# Altium schematic sheet CO2_Sensor_Unit_board - Copy.SchDoc
size A2
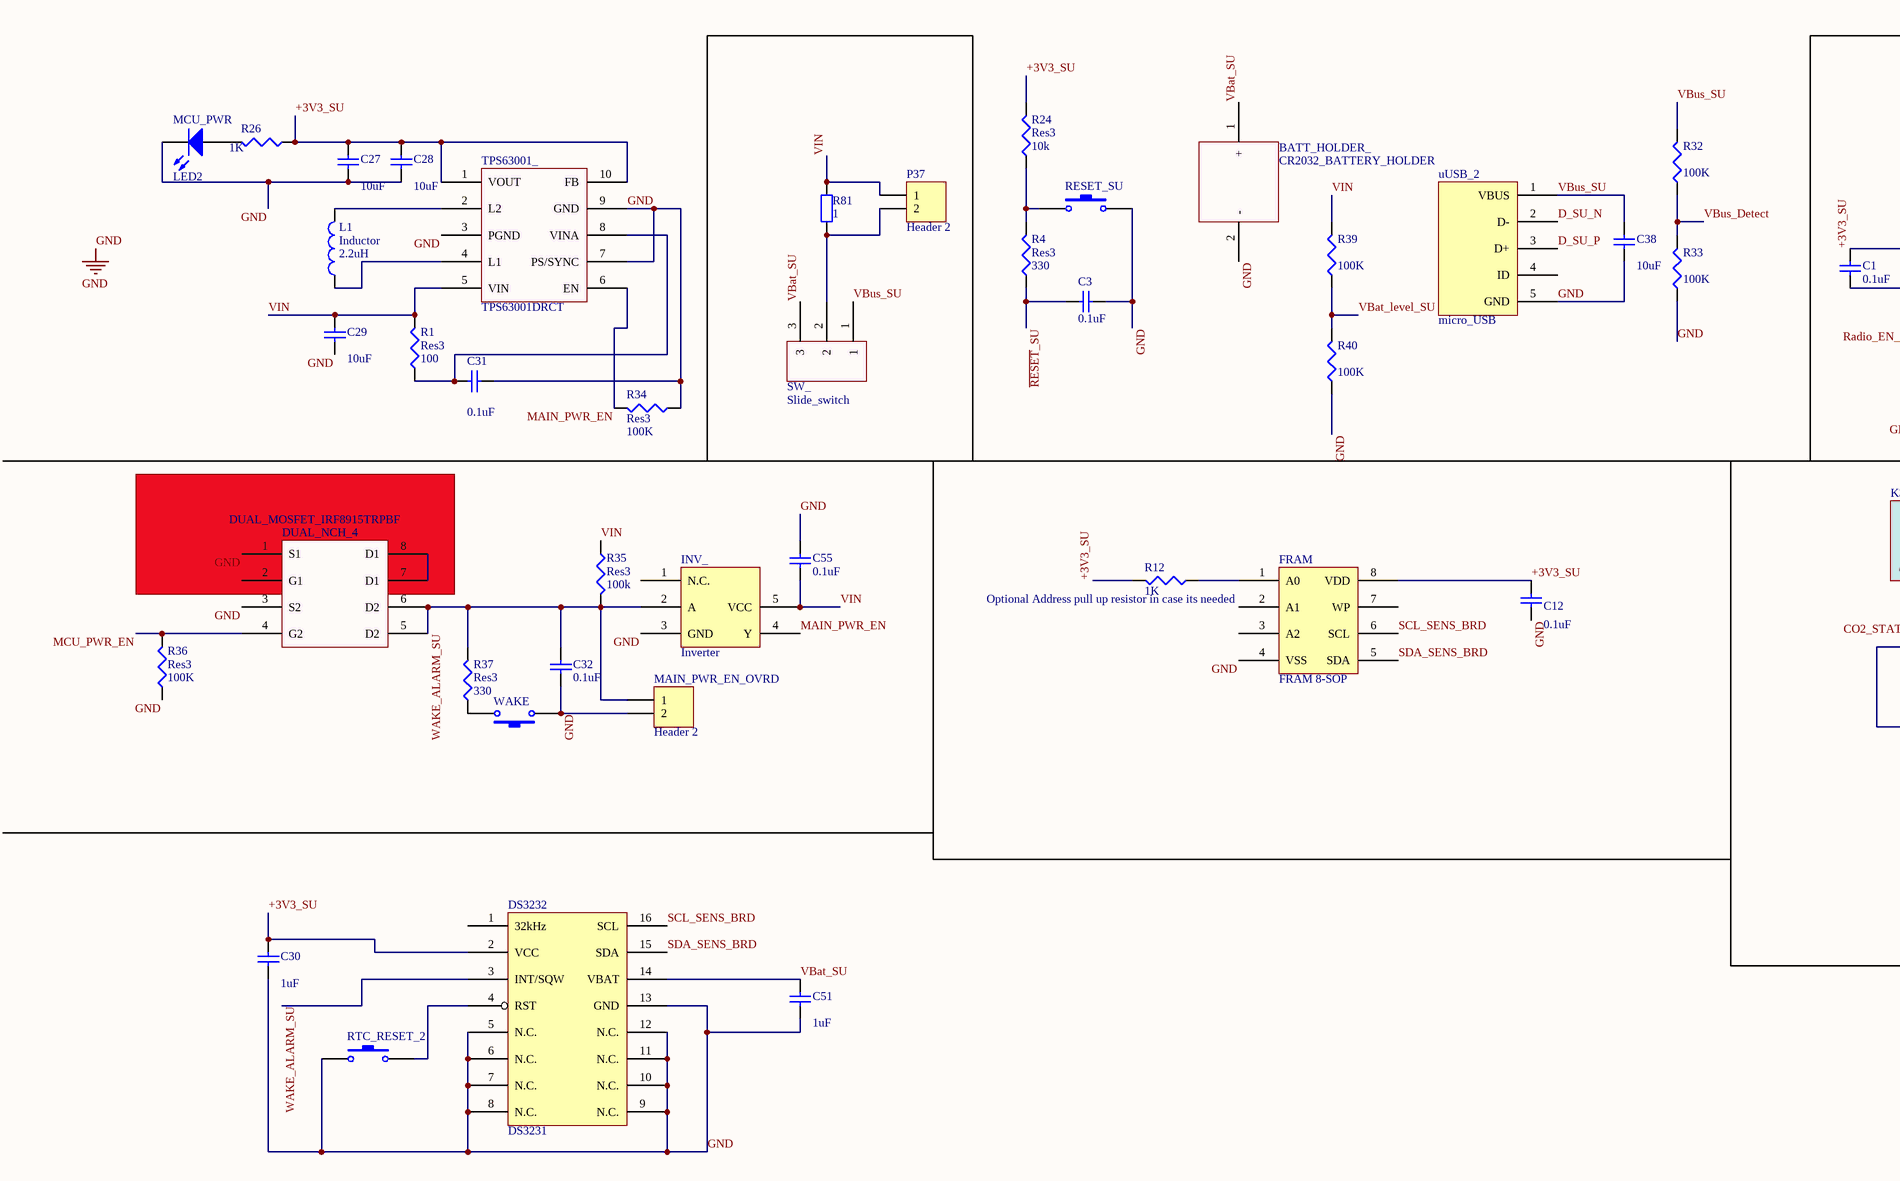
[diagram p0: CO2_Sensor_Unit_board - Copy.SchDoc, top left]
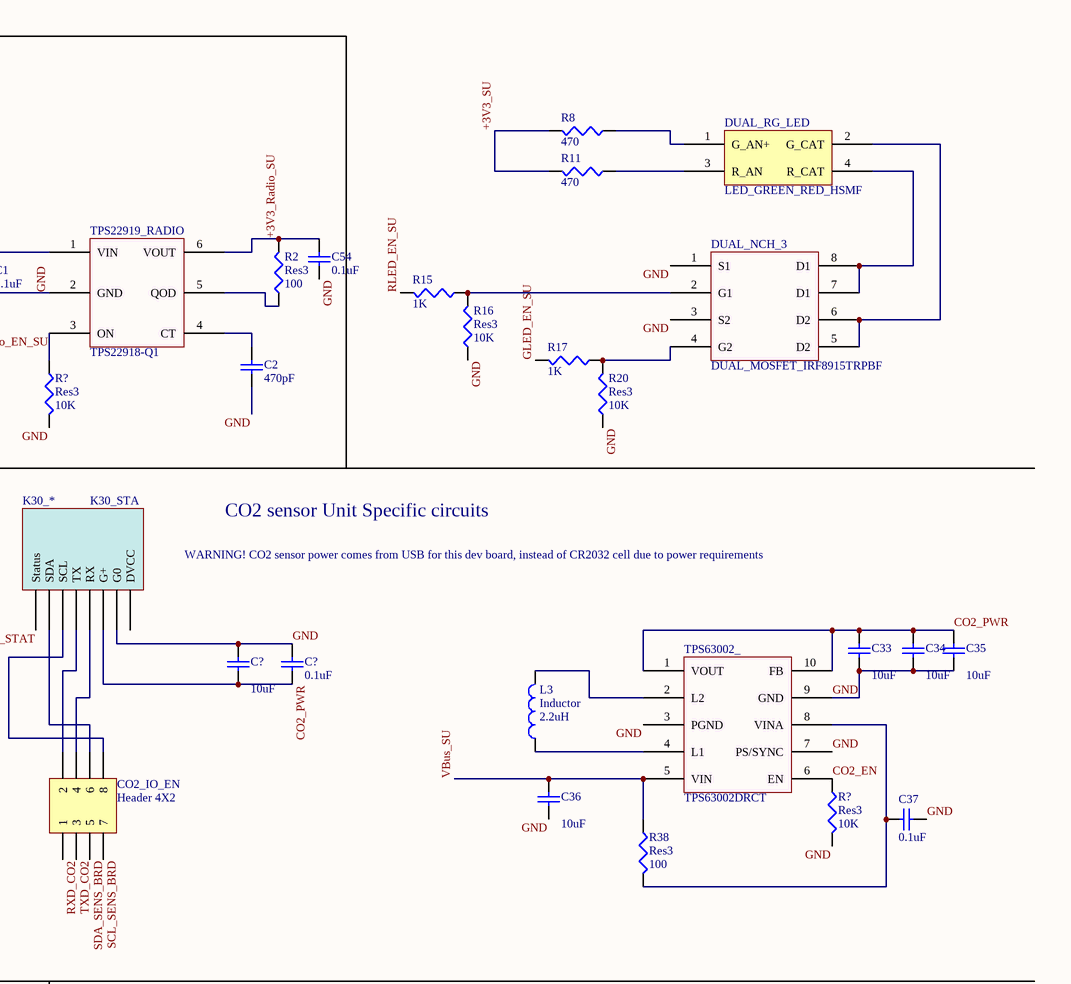
[diagram p1: CO2_Sensor_Unit_board - Copy.SchDoc, top right]
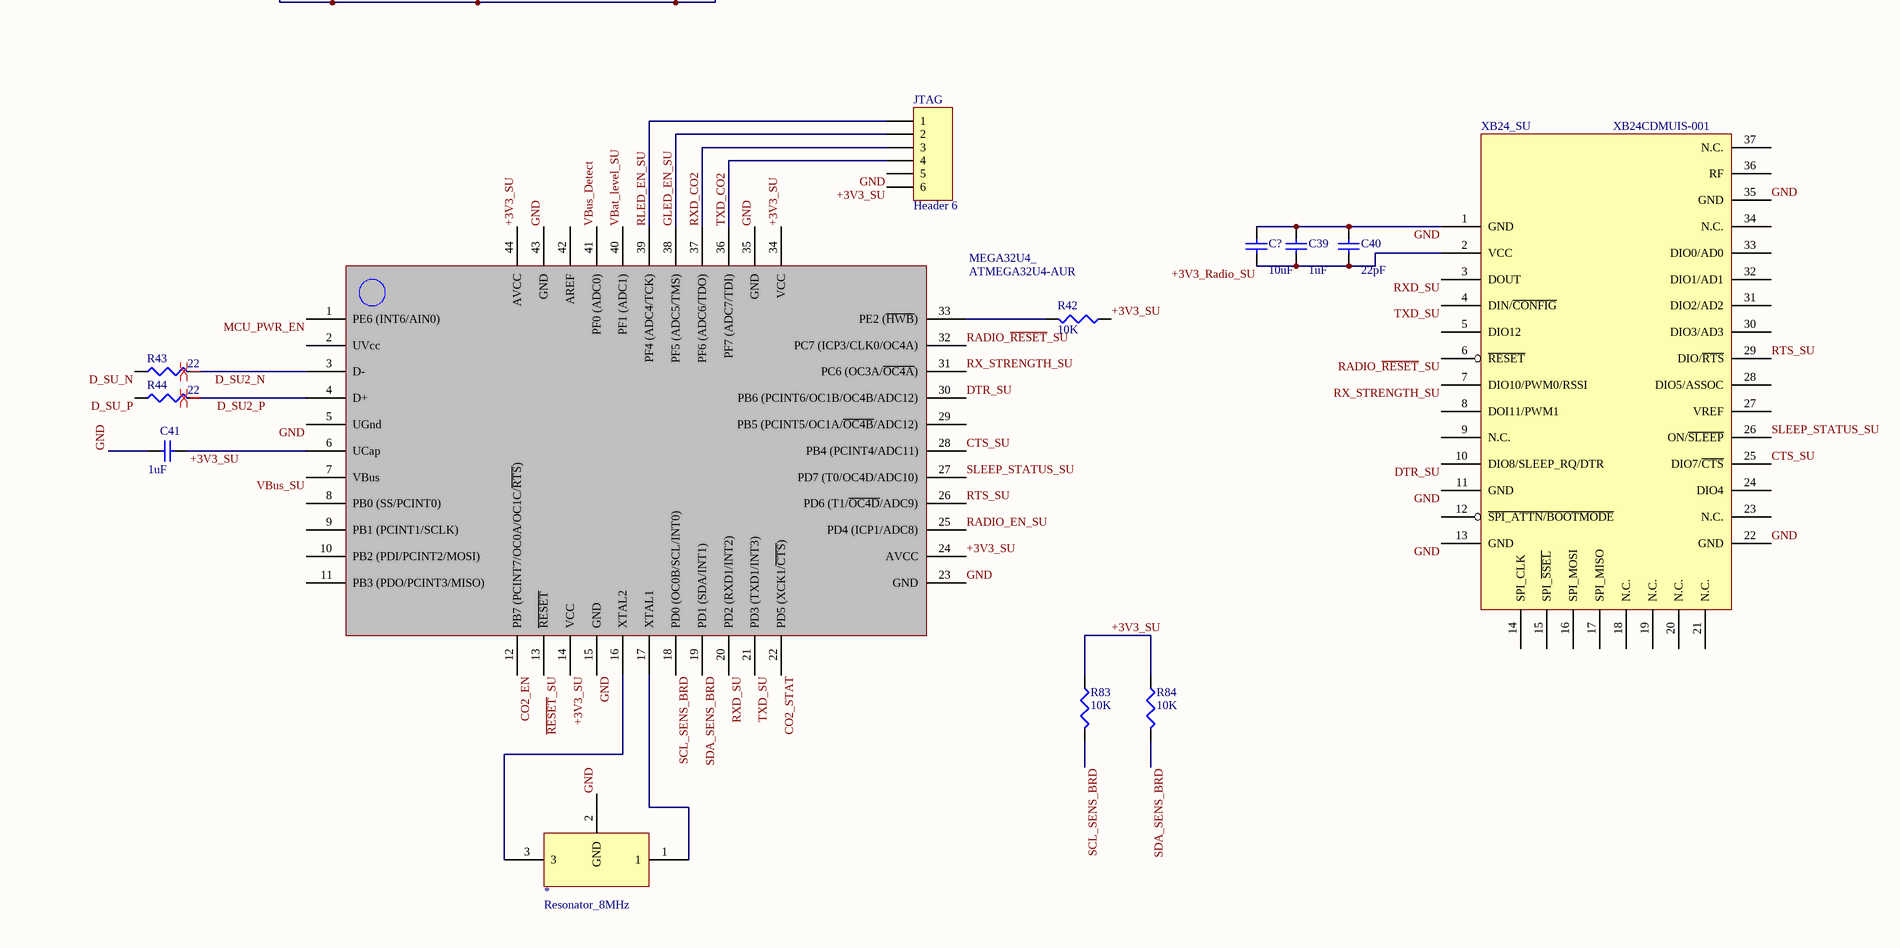
[diagram p2: CO2_Sensor_Unit_board - Copy.SchDoc, bottom left]

## Parts
(Parts that share a designator on the sheet are numbered #1, #2 ... from top to bottom, then left to right.)
*  Resonator_8MHz  [Resonator_8MHz]
BATT_HOLDER_  CR2032_BATTERY_HOLDER  [CR2032_battery_holder]
C1  value 0.1uF  [C0805]  (hidden comment: Cap Semi)
C2  value 470pF  [C0805]  (hidden comment: Cap Semi)
C3  value 0.1uF  [C0805]  (hidden comment: Cap Semi)
C12  value 0.1uF  [C0805]  (hidden comment: Cap Semi)
C27  value 10uF  [1608[0603]]  (hidden comment: Cap Semi)
C28  value 10uF  [1608[0603]]  (hidden comment: Cap Semi)
C29  value 10uF  [1608[0603]]  (hidden comment: Cap Semi)
C30  value 1uF  [C0805]  (hidden comment: Cap Semi)
C31  value 0.1uF  [C0805]  (hidden comment: Cap Semi)
C32  value 0.1uF  [C0805]  (hidden comment: Cap Semi)
C33  value 10uF  [1608[0603]]  (hidden comment: Cap Semi)
C34  value 10uF  [1608[0603]]  (hidden comment: Cap Semi)
C35  value 10uF  [1608[0603]]  (hidden comment: Cap Semi)
C36  value 10uF  [1608[0603]]  (hidden comment: Cap Semi)
C37  value 0.1uF  [C0805]  (hidden comment: Cap Semi)
C38  value 10uF  [1608[0603]]  (hidden comment: Cap Semi)
C39  value 1uF  [C0805]  (hidden comment: Cap Semi)
C40  value 22pF  [1608[0603]]  (hidden comment: Cap Semi)
C41  value 1uF  [C0805]  (hidden comment: Cap Semi)
C51  value 1uF  [C0805]  (hidden comment: Cap Semi)
C54  value 0.1uF  [C0805]  (hidden comment: Cap Semi)
C55  value 0.1uF  [C0805]  (hidden comment: Cap Semi)
C?#1  value 10uF  [1608[0603]]  (hidden comment: Cap Semi)
C?#2  value 0.1uF  [C0805]  (hidden comment: Cap Semi)
C?#3  value 10uF  [1608[0603]]  (hidden comment: Cap Semi)
CO2_IO_EN  Header 4X2  [HDR2X4]
DS3232  DS3231  [16 SO]
DUAL_NCH_3  DUAL_MOSFET_IRF8915TRPBF  [SOP-8]
DUAL_NCH_4  DUAL_MOSFET_IRF8915TRPBF  [SOP-8]
DUAL_RG_LED  LED_GREEN_RED_HSMF  [LED4]
FRAM  FRAM 8-SOP  [SOP-8]
INV_  Inverter  [SOT-23]
JTAG  Header 6  [HDR1X6]
K30_*  K30_STA  [K30_STA]
L1  Inductor  value 2.2uH  [2.2uH_Inductor]
L3  Inductor  value 2.2uH  [2.2uH_Inductor]
MAIN_PWR_EN_OVRD  Header 2  [HDR1X2]
MCU_PWR  LED2  [LED_Single_Orange]
MEGA32U4_  ATMEGA32U4-AUR  [Quad44]
P37  Header 2  [HDR1X2]
R1  Res3  value 100  [6-0805_N]
R2  Res3  value 100  [6-0805_N]
R4  Res3  value 330  [6-0805_N]
R8  value 470  [6-0805_N]  (hidden comment: Res3)
R11  value 470  [6-0805_N]  (hidden comment: Res3)
R12  value 1K  [6-0805_N]  (hidden comment: Res3)
R15  value 1K  [6-0805_N]  (hidden comment: Res3)
R16  Res3  value 10K  [6-0805_N]
R17  value 1K  [6-0805_N]  (hidden comment: Res3)
R20  Res3  value 10K  [6-0805_N]
R24  Res3  value 10k  [6-0805_N]
R26  value 1K  [6-0805_N]  (hidden comment: Res3)
R32  value 100K  [6-0805_N]  (hidden comment: Res3)
R33  value 100K  [6-0805_N]  (hidden comment: Res3)
R34  Res3  value 100K  [6-0805_N]
R35  Res3  value 100k  [6-0805_N]
R36  Res3  value 100K  [6-0805_N]
R37  Res3  value 330  [6-0805_N]
R38  Res3  value 100  [6-0805_N]
R39  value 100K  [6-0805_N]  (hidden comment: Res3)
R40  value 100K  [6-0805_N]  (hidden comment: Res3)
R42  value 10K  [6-0805_N]  (hidden comment: Res3)
R43  value 22  [6-0805_N]  (hidden comment: Res3)
R44  value 22  [6-0805_N]  (hidden comment: Res3)
R81  value 1  [1206 [3216 Metric]]  (hidden comment: Res2)
R83  value 10K  [6-0805_N]  (hidden comment: Res3)
R84  value 10K  [6-0805_N]  (hidden comment: Res3)
R?#1  Res3  value 10K  [6-0805_N]
R?#2  Res3  value 10K  [6-0805_N]
RESET_SU  SW-PB  [SW_TACTILE]  (value not drawn)
RTC_RESET_2  SW-PB  [SW_TACTILE]  (value not drawn)
SW_  Slide_switch  [Slide_SW]
TPS22919_RADIO  TPS22918-Q1  [SOT-23-6]
TPS63001_  TPS63001DRCT  [SON10]
TPS63002_  TPS63002DRCT  [SON10]
uUSB_2  micro_USB  [MicroUSB_CONN]
WAKE  SW-PB  [SW_TACTILE]  (value not drawn)
XB24_SU  XB24CDMUIS-001  [XB24_RADIO]

## Nets
GND: *.2(GND) BATT_HOLDER_.2(-) C1.2 C2.2 C3.1 C12.1 C27.2 C28.2 C29.1 C30.1 C31.1 C32.2 C33.2 C34.2 C35.2 C36.1 C37.2 C38.1 C39.2 C40.2 C41.1 C51.1 C54.2 C55.1 C?#1.2 C?#2.2 C?#3.2 DS3232.5(N.C.) DS3232.6(N.C.) DS3232.7(N.C.) DS3232.8(N.C.) DS3232.9(N.C.) DS3232.10(N.C.) DS3232.11(N.C.) DS3232.12(N.C.) DS3232.13(GND) DUAL_NCH_3.1(S1) DUAL_NCH_3.3(S2) DUAL_NCH_4.1(S1) DUAL_NCH_4.3(S2) FRAM.4(VSS) INV_.3(GND) JTAG.5 K30_*.7(G0) MAIN_PWR_EN_OVRD.2 MCU_PWR.2(K) MEGA32U4_.5(UGnd) MEGA32U4_.15(GND) MEGA32U4_.23(GND) MEGA32U4_.35(GND) MEGA32U4_.43(GND) R16.1 R20.1 R33.1 R34.1 R36.1 R40.1 R?#1.2 R?#2.2 RESET_SU.2 RTC_RESET_2.1 TPS22919_RADIO.2(GND) TPS63001_.3(PGND) TPS63001_.7(PS/SYNC) TPS63001_.9(GND) TPS63002_.3(PGND) TPS63002_.7(PS/SYNC) TPS63002_.9(GND) uUSB_2.5(GND) WAKE.1 XB24_SU.1(GND) XB24_SU.11(GND) XB24_SU.13(GND) XB24_SU.22(GND) XB24_SU.35(GND)
+3V3_Radio_SU: C39.1 C40.1 C54.1 C?#3.1 R2.2 TPS22919_RADIO.6(VOUT) XB24_SU.2(VCC)
+3V3_SU: C1.1 C12.2 C27.1 C28.1 C30.2 C41.2 DS3232.2(VCC) FRAM.8(VDD) JTAG.6 MEGA32U4_.6(UCap) MEGA32U4_.14(VCC) MEGA32U4_.24(AVCC) MEGA32U4_.34(VCC) MEGA32U4_.44(AVCC) R8.2 R11.2 R12.2 R24.2 R26.1 R42.1 R83.1 R84.1 TPS22919_RADIO.1(VIN) TPS63001_.1(VOUT) TPS63001_.10(FB)
CO2_EN: MEGA32U4_.12(PB7_(PCINT7/OC0A/OC1C/~{RTS})) R?#2.1 TPS63002_.6(EN)
CO2_PWR: C33.1 C34.1 C35.1 C?#1.1 C?#2.1 K30_*.6(G+) TPS63002_.1(VOUT) TPS63002_.10(FB)
CO2_STAT: K30_*.1(Status) MEGA32U4_.22(PD5_(XCK1/~{CTS}))
CTS_SU: MEGA32U4_.28(PB4_(PCINT4/ADC11)) XB24_SU.25(DIO7/~{CTS})
D_SU2_N: MEGA32U4_.3(D-) R43.2
D_SU2_P: MEGA32U4_.4(D+) R44.2
D_SU_N: R43.1 uUSB_2.2(D-)
D_SU_P: R44.1 uUSB_2.3(D+)
DTR_SU: MEGA32U4_.30(PB6_(PCINT6/OC1B/OC4B/ADC12)) XB24_SU.10(DIO8/SLEEP_RQ/DTR)
GLED_EN_SU: JTAG.2 MEGA32U4_.38(PF5_(ADC5/TMS)) R17.2
MAIN_PWR_EN: INV_.4(Y) R34.2 TPS63001_.6(EN)
MCU_PWR_EN: DUAL_NCH_4.4(G2) MEGA32U4_.1(PE6_(INT6/AIN0)) R36.2
~{RESET}_SU: C3.2 MEGA32U4_.13(~{RESET}) R4.1
Radio_EN_SU: MEGA32U4_.25(PD4_(ICP1/ADC8)) R?#1.1 TPS22919_RADIO.3(ON)
RADIO_~{RESET}_SU: MEGA32U4_.32(PC7_(ICP3/CLK0/OC4A)) XB24_SU.6(~{RESET})
RLED_EN_SU: JTAG.1 MEGA32U4_.39(PF4_(ADC4/TCK)) R15.2
RTS_SU: MEGA32U4_.26(PD6_(T1/~{OC4D}/ADC9)) XB24_SU.29(DIO/~{RTS})
RX_STRENGTH_SU: MEGA32U4_.31(PC6_(OC3A/~{OC4A})) XB24_SU.7(DIO10/PWM0/RSSI)
RXD_CO2: CO2_IO_EN.1 JTAG.3 MEGA32U4_.37(PF6_(ADC6/TDO))
RXD_SU: MEGA32U4_.20(PD2_(RXD1/INT2)) XB24_SU.3(DOUT)
SCL_SENS_BRD: CO2_IO_EN.7 DS3232.16(SCL) FRAM.6(SCL) MEGA32U4_.18(PD0_(OC0B/SCL/INT0)) R83.2
SDA_SENS_BRD: CO2_IO_EN.5 DS3232.15(SDA) FRAM.5(SDA) MEGA32U4_.19(PD1_(SDA/INT1)) R84.2
SLEEP_STATUS_SU: MEGA32U4_.27(PD7_(T0/OC4D/ADC10)) XB24_SU.26(ON/~{SLEEP})
TXD_CO2: CO2_IO_EN.3 JTAG.4 MEGA32U4_.36(PF7_(ADC7/TDI))
TXD_SU: MEGA32U4_.21(PD3_(TXD1/INT3)) XB24_SU.4(DIN/~{CONFIG})
VBat_level_SU: MEGA32U4_.40(PF1_(ADC1)) R39.1 R40.2
VBat_SU: BATT_HOLDER_.1(+) C51.2 DS3232.14(VBAT) SW_.3
VBus_Detect: MEGA32U4_.41(PF0_(ADC0)) R32.1 R33.2
VBus_SU: C36.2 C38.2 MEGA32U4_.7(VBus) R32.2 R38.1 SW_.1 TPS63002_.5(VIN) uUSB_2.1(VBUS)
VIN: C29.2 C55.2 INV_.5(VCC) P37.1 R1.2 R35.1 R39.2 R81.2 TPS63001_.5(VIN)
WAKE_ALARM_SU: C32.1 DS3232.3(INT/SQW) DUAL_NCH_4.5(D2) DUAL_NCH_4.6(D2) INV_.2(A) MAIN_PWR_EN_OVRD.1 R35.2 R37.2
Net*_1: *.1 MEGA32U4_.17(XTAL1)
Net*_3: *.3 MEGA32U4_.16(XTAL2)
NetC2_1: C2.1 TPS22919_RADIO.4(CT)
NetC31_2: C31.2 R1.1 TPS63001_.8(VINA)
NetC37_1: C37.1 R38.2 TPS63002_.8(VINA)
NetCO2_IO_EN_2: CO2_IO_EN.2 K30_*.4(TX)
NetCO2_IO_EN_4: CO2_IO_EN.4 K30_*.5(RX)
NetCO2_IO_EN_6: CO2_IO_EN.6 K30_*.2(SDA)
NetCO2_IO_EN_8: CO2_IO_EN.8 K30_*.3(SCL)
NetDS3232_4: DS3232.4(RST) RTC_RESET_2.2
NetDUAL_NCH_3_2: DUAL_NCH_3.2(G1) R15.1 R16.2
NetDUAL_NCH_3_4: DUAL_NCH_3.4(G2) R17.1 R20.2
NetDUAL_NCH_3_5: DUAL_NCH_3.5(D2) DUAL_NCH_3.6(D2) DUAL_RG_LED.2(G_CAT)
NetDUAL_NCH_3_7: DUAL_NCH_3.7(D1) DUAL_NCH_3.8(D1) DUAL_RG_LED.4(R_CAT)
NetDUAL_NCH_4_7: DUAL_NCH_4.7(D1) DUAL_NCH_4.8(D1)
NetDUAL_RG_LED_1: DUAL_RG_LED.1(G_AN+) R8.1
NetDUAL_RG_LED_3: DUAL_RG_LED.3(R_AN) R11.1
NetFRAM_1: FRAM.1(A0) R12.1
NetL1_1: L1.1 TPS63001_.4(L1)
NetL1_2: L1.2 TPS63001_.2(L2)
NetL3_1: L3.1 TPS63002_.4(L1)
NetL3_2: L3.2 TPS63002_.2(L2)
NetMCU_PWR_1: MCU_PWR.1(A) R26.2
NetMEGA32U4__33: MEGA32U4_.33(PE2_(~{HWB})) R42.2
NetP37_2: P37.2 R81.1 SW_.2
NetR2_1: R2.1 TPS22919_RADIO.5(QOD)
NetR4_2: R4.2 R24.1 RESET_SU.1
NetR37_1: R37.1 WAKE.2

Not connected (* = marked no-connect by the designer): DS3232 1(32kHz); DUAL_NCH_4 2(G1); FRAM 2(A1) 3(A2) 7(WP); INV_ 1(N.C.); K30_* 8(DVCC); MEGA32U4_ 2(UVcc) 8(PB0_(SS/PCINT0)) 9(PB1_(PCINT1/SCLK)) 10(PB2_(PDI/PCINT2/MOSI)) 11(PB3_(PDO/PCINT3/MISO)) 29(PB5_(PCINT5/OC1A/~{OC4B}/ADC12)) 42(AREF); uUSB_2 4(ID); XB24_SU 5(DIO12) 8(DOI11/PWM1) 9(N.C.) 12(~{SPI_ATTN/BOOTMODE}) 14(SPI_CLK) 15(SPI_~{SSEL}) 16(SPI_MOSI) 17(SPI_MISO) 18(N.C.) 19(N.C.) 20(N.C.) 21(N.C.) 23(N.C.) 24(DIO4) 27(VREF) 28(DIO5/ASSOC) 30(DIO3/AD3) 31(DIO2/AD2) 32(DIO1/AD1) 33(DIO0/AD0) 34(N.C.) 36(RF) 37(N.C.)

## Layout directives
differential pair: D_SU2_N, D_SU2_P

## Notes on the sheet
- CO2 sensor Unit Specific circuits
- WARNING! CO2 sensor power comes from USB for this dev board, instead of CR2032 cell due to power requirements
- (near FRAM) Optional Address pull up resistor in case its needed

## Library data of the parts
C1-C3 C12 C27-C41 C51 C54 C55 C?#1-C?#3 = Cap Semi: Capacitor (Semiconductor SIM Model); Published: 8-Jun-2000; LatestRevisionDate: 29-May-2009; LatestRevisionNote: IPC-7351 Footprint Added.; PackageReference: C1206; Publisher: Altium Limited; PackageDescription: Chip Capacitor
CO2_IO_EN = Header 4X2: Header, 4-Pin, Dual row; LatestRevisionDate: 17-Jul-2002; LatestRevisionNote: Re-released for DXP Platform.; Publisher: Altium Limited
INV_ = SN74LVC1GU04
JTAG = Header 6: Header, 6-Pin; LatestRevisionDate: 17-Jul-2002; LatestRevisionNote: Re-released for DXP Platform.; Publisher: Altium Limited
L1 L3 = Inductor: Code_IEC: 1005; Published: 8-Jun-2000; LatestRevisionDate: 29-May-2009; LatestRevisionNote: IPC-7351 Footprint Added.; PackageReference: 0402-A; Publisher: Altium Limited; PackageDescription: Chip Inductor; Code_JEITA: 0402
MAIN_PWR_EN_OVRD P37 = Header 2: Header, 2-Pin; LatestRevisionDate: 17-Jul-2002; LatestRevisionNote: Re-released for DXP Platform.; Publisher: Altium Limited
MCU_PWR = LED2: Typical RED, GREEN, YELLOW, AMBER GaAs LED; Published: 8-Jun-2000; LatestRevisionDate: 17-Jul-2002; LatestRevisionNote: Re-released for DXP Platform.; PackageVersion: Feb-2002; PackageReference: 3.2X1.6X1.1; Publisher: Altium Limited; PackageDescription: SM LED; 2 Flat Leads
R1 R2 R4 R8 R11 R12 R15-R17 R20 R24 R26 R32-R40 R42-R44 R83 R84 R?#1 R?#2 = Res3: Resistor; Published: 8-Jun-2000; LatestRevisionDate: 29-May-2009; LatestRevisionNote: IPC-7351 Footprint Added.; PackageReference: J1-0603; Publisher: Altium Limited; PackageDescription: Chip Resistor
R81 = Res2: Resistor; Published: 8-Jun-2000; LatestRevisionDate: 17-Jul-2002; LatestRevisionNote: Re-released for DXP Platform.; PackageReference: AXIAL-0.4; Publisher: Altium Limited; PackageDescription: Axial Device, Thru-Hole; 2 Leads; 0.4 in Pin Spacing
RESET_SU RTC_RESET_2 WAKE = SW-PB: Switch; Published: 24-Mar-1999; LatestRevisionDate: 17-Jul-2002; LatestRevisionNote: Re-released for DXP Platform.; PackageReference: SPST-2; Publisher: Altium Limited; PackageDescription: Switch; 2 Leads
TPS63002_ = TPS63001DRCT